# Altium schematic sheet Sheet1.SchDoc
size A4; SheetNumber: 1; SheetTotal: 1
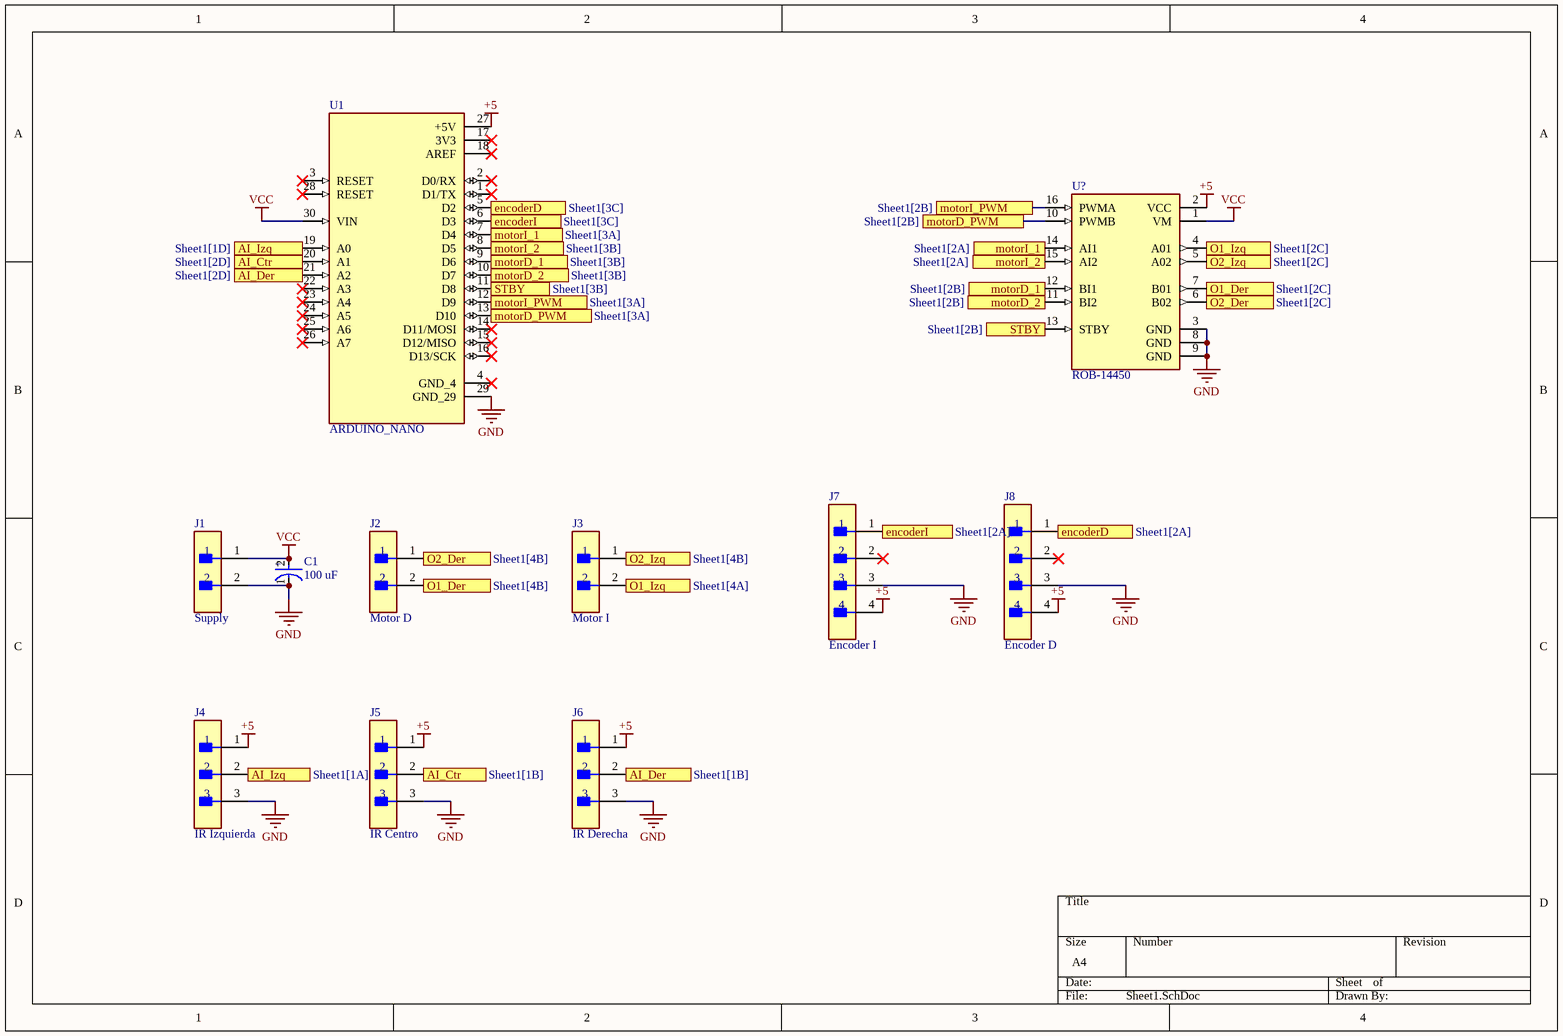
[diagram p0: Sheet1.SchDoc]

## Parts
C1  100 uF  [FP-RAD-TH-D_5_0_5-L_11_1-MFG]
J1  Supply  [FP-B2B-XH-A_LF_SN-MFG]
J2  Motor D  [FP-B2B-XH-A_LF_SN-MFG]
J3  Motor I  [FP-B2B-XH-A_LF_SN-MFG]
J4  IR Izquierda  [FP-B3B-XH-A_LF_SN-MFG]
J5  IR Centro  [FP-B3B-XH-A_LF_SN-MFG]
J6  IR Derecha  [FP-B3B-XH-A_LF_SN-MFG]
J7  Encoder I  [FP-B4B-XH-A_LF_SN-MFG]
J8  Encoder D  [FP-B4B-XH-A_LF_SN-MFG]
U1  ARDUINO_NANO  [MODULE_ARDUINO_NANO]
U?  ROB-14450  [MODULE_ROB-14450]

## Ports
AI_Ctr (see Sheet1[1B]), AI_Ctr (see Sheet1[2D]), AI_Der (see Sheet1[1B]), AI_Der (see Sheet1[2D]), AI_Izq (see Sheet1[1A]), AI_Izq (see Sheet1[1D]), encoderD (see Sheet1[2A]), encoderD (see Sheet1[3C]), encoderI (see Sheet1[2A]), encoderI (see Sheet1[3C]), motorD_1 (see Sheet1[2B]), motorD_1 (see Sheet1[3B]), motorD_2 (see Sheet1[2B]), motorD_2 (see Sheet1[3B]), motorD_PWM (see Sheet1[2B]), motorD_PWM (see Sheet1[3A]), motorI_1 (see Sheet1[2A]), motorI_1 (see Sheet1[3A]), motorI_2 (see Sheet1[2A]), motorI_2 (see Sheet1[3B]), motorI_PWM (see Sheet1[2B]), motorI_PWM (see Sheet1[3A]), O1_Der (see Sheet1[2C]), O1_Der (see Sheet1[4B]), O1_Izq (see Sheet1[2C]), O1_Izq (see Sheet1[4A]), O2_Der (see Sheet1[2C]), O2_Der (see Sheet1[4B]), O2_Izq (see Sheet1[2C]), O2_Izq (see Sheet1[4B]), STBY (see Sheet1[2B]), STBY (see Sheet1[3B])

## Nets
+5: J4.1 J5.1 J6.1 J7.4 J8.4 U1.27(+5V) U?.2(VCC)
GND: C1.1(C) J1.2 J4.3 J5.3 J6.3 J7.3 J8.3 U1.29(GND_29) U?.3(GND) U?.8(GND) U?.9(GND)
VCC: C1.2(A) J1.1 U1.30(VIN) U?.1(VM)
AI_Ctr: J5.2 U1.20(A1) ; port AI_Ctr
AI_Der: J6.2 U1.21(A2) ; port AI_Der
AI_Izq: J4.2 U1.19(A0) ; port AI_Izq
encoderD: J8.1 U1.5(D2) ; port encoderD
encoderI: J7.1 U1.6(D3) ; port encoderI
motorD_1: U1.9(D6) U?.12(BI1) ; port motorD_1
motorD_2: U1.10(D7) U?.11(BI2) ; port motorD_2
motorD_PWM: U1.13(D10) U?.10(PWMB) ; port motorD_PWM
motorI_1: U1.7(D4) U?.14(AI1) ; port motorI_1
motorI_2: U1.8(D5) U?.15(AI2) ; port motorI_2
motorI_PWM: U1.12(D9) U?.16(PWMA) ; port motorI_PWM
O1_Der: J2.2 U?.7(B01) ; port O1_Der
O1_Izq: J3.2 U?.4(A01) ; port O1_Izq
O2_Der: J2.1 U?.6(B02) ; port O2_Der
O2_Izq: J3.1 U?.5(A02) ; port O2_Izq
STBY: U1.11(D8) U?.13(STBY) ; port STBY

Not connected (* = marked no-connect by the designer): J7 2*; J8 2*; U1 1(D1/TX)* 2(D0/RX)* 3(RESET)* 4(GND_4)* 14(D11/MOSI)* 15(D12/MISO)* 16(D13/SCK)* 17(3V3)* 18(AREF)* 22(A3)* 23(A4)* 24(A5)* 25(A6)* 26(A7)* 28(RESET)*

## Notes on the sheet
- (in symbol CMP-05427-001295-1) +

## Library data of the parts
C1 = CMP-05427-001295-1: Aluminum Electrolytic Capacitors (Radial Lead Type) 100uF ±20% 16V; Lead Diameter: 0.5mm; Life (Hours): 5000Hour; Voltage Rating: 50V; Impedance: 340mR; Capacitance: 10uF; Ripple Current (AC): 250mA; REACH SVHC: Yes; Tolerance: 20%; Construction: RADIAL; Min Operating Temperature: -40°C; Termination: Radial; Height: 11mm; Max Operating Temperature: 105°C; Voltage: 50V; Diameter: 5mm; Lead Pitch: 2mm; Series: FR Radial; RoHS Compliant: Yes; Case/Package: Radial
J1-J3 = CMP-2000-05888-3: CONN HEADER VERT 2POS 2.5MM; Current Rating: 3A; Voltage Rating: 250V; Number of Contacts: 2; Contact Resistance: 20mR; Wire/Cable Gauge: 22AWG; Insulation Resistance: 1GR; Connector Type: Male Pin; Packaging: Bulk; Contact Material: Brass; Lead Free: Lead Free; Orientation: Straight; Contact Plating: Tin; Max Current Rating: 3A; Termination: Solder; Fastening Type: Detent; Depth: 5.75mm; Housing Material: Polyamide; REACH SVHC: No SVHC; Series: XH; Voltage Rating (AC): 250V; Number of Positions: 2; Color: Natural; Contact Type: Male Pin; Max Voltage Rating (DC): 250V; Pitch: 2.5mm; Lead Pitch: 2.5mm; Mount: Through Hole; Max Operating Temperature: 85°C; Length: 7.4mm; Max Voltage Rating (AC): 250V; Min Operating Temperature: -25°C; Number of Rows: 1; Housing Color: White
J4-J6 = CMP-17439-000014-3: CONN HEADER VERT 3POS 2.5MM; Max Voltage Rating (DC): 250V; Number of Positions: 3; Current Rating: 3A; Gender: Male; Wire/Cable Gauge: 22AWG; Contact Resistance: 20mR; Insulation Resistance: 1GR; Insulation Material: Nylon; Contact Plating: Tin; Depth: 5.75mm; Contact Type: Male Pin; Max Operating Temperature: 85°C; Insulation Color: Natural; Voltage Rating (AC): 250V; Color: Natural; Connector Type: Header; Orientation: Straight; Fastening Type: Detent; Housing Color: White; Min Operating Temperature: -25°C; Termination: Solder; Voltage Rating: 250V; Series: XH; Pitch: 2.5mm; Contact Shape: Square; Number of Rows: 1; Lead Free: Lead Free; Packaging: Bulk; Mount: Through Hole; Flammability Rating: UL94 V-0; Max Voltage Rating (AC): 250V; REACH SVHC: No SVHC; Housing Material: Polyamide; Contact Material: Brass; Lead Pitch: 2.5mm; Contact Finish - Mating: TIN; Length: 9.9mm; Max Current Rating: 3A; Number of Contacts: 3
J7 J8 = CMP-17439-000250-1: CONN HEADER VERT 4POS 2.5MM; Number of Contacts: 4; Contact Resistance: 20mR; Voltage Rating: 250V; Max Current Rating: 3A; Gender: Male; Wire/Cable Gauge: 22AWG; Mated Stacking Heights: 9.8mm; Insulation Resistance: 1GR; Orientation: Straight; Contact Type: Male Pin; Contact Finish - Mating: TIN; Series: XH; Max Voltage Rating (AC): 250V; Lead Pitch: 2.5mm; Contact Shape: Square; Insulation Color: Natural; Termination: Solder; Lead Free: Lead Free; Voltage Rating (AC): 250V; Number of Rows: 1; Flammability Rating: UL94 V-0; Number of Positions: 4; Max Operating Temperature: 85°C; Package Quantity: 500; Mount: Through Hole; REACH SVHC: No SVHC; Connector Type: Header; Insulation Material: Nylon; Fastening Type: Detent; Min Operating Temperature: -25°C; Housing Color: White; Packaging: Bulk; Contact Plating: Tin; Contact Material: Brass; Max Voltage Rating (DC): 250V; Housing Material: Polyamide; Color: Natural; Material: Polyamide; Pitch: 2.5mm; Depth: 5.75mm; Current Rating: 3A; Length: 12.4mm
U1 = ARDUINO_NANO: Small, complete, and breadboard-friendly board based on the ATmega328 (Arduino Nano 3.x); SnapEDA_Link: https://www.snapeda.com/parts/Arduino%20Nano/Arduino/view-part/?ref=snap; Package: Non-Standard Arduino; Value: *; MF: Arduino; MP: Arduino Nano; Check_prices: https://www.snapeda.com/parts/Arduino%20Nano/Arduino/view-part/?ref=eda
U? = ROB-14450: TB6612FNG Motor Controller/Driver Power Management Evaluation Board; MF: SparkFun Electronics; Check_prices: https://www.snapeda.com/parts/ROB-14450/SparkFun%20Electronics/view-part/2656367/?ref=eda; Package: None; MP: ROB-14450; Value: *; Availability: In Stock; SnapEDA_Link: https://www.snapeda.com/parts/ROB-14450/SparkFun%20Electronics/view-part/2656367/?ref=snap; Price: None